# Altium schematic sheet I2C_SENSOR.SchDoc: I2C_SENSOR
size 420 x 297 mm; SheetNumber: 9; SheetTotal: 11
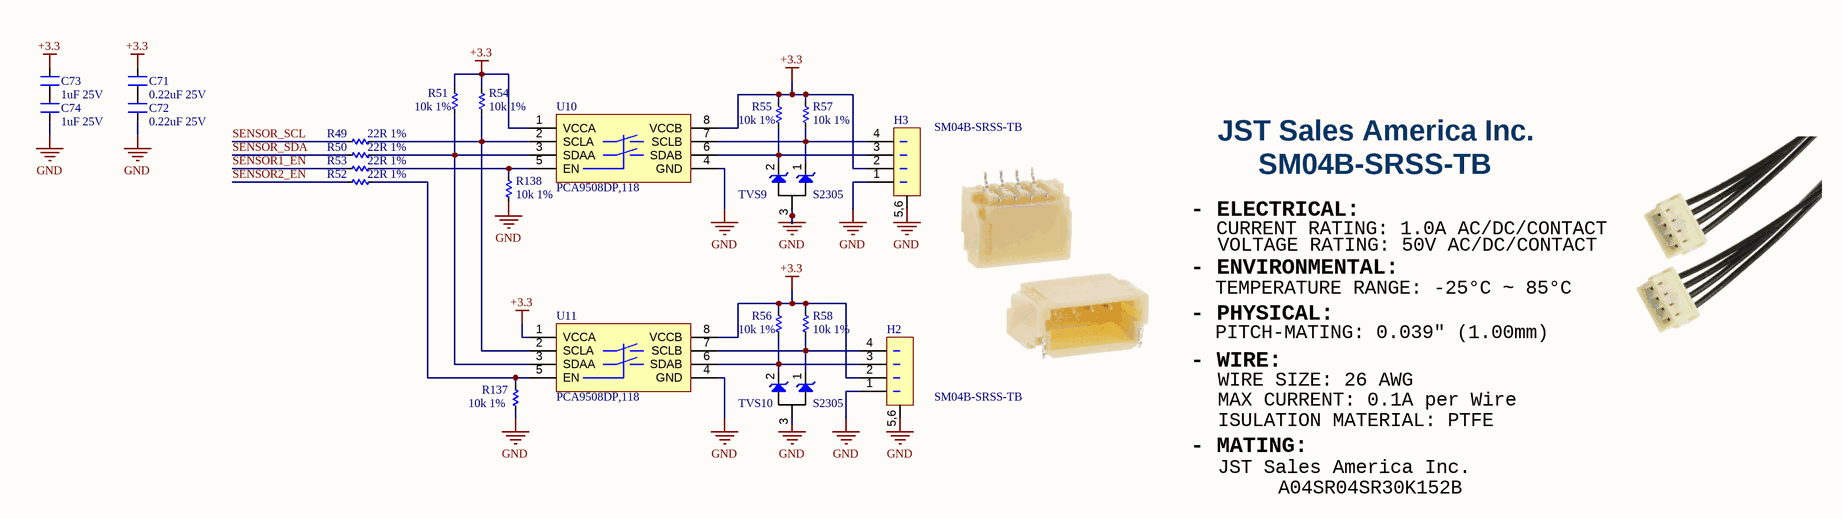
[diagram p0: I2C_SENSOR.SchDoc]

## Parts
C71  0.22uF 25V  [CN-SMD-0603]
C72  0.22uF 25V  [CN-SMD-0603]
C73  1uF 25V  [CN-SMD-0603]
C74  1uF 25V  [CN-SMD-0603]
H2  SM04B-SRSS-TB  [CONN_SM04B_JST]
H3  SM04B-SRSS-TB  [CONN_SM04B_JST]
R49  22R 1%  [RES-SMD-0603]
R50  22R 1%  [RES-SMD-0603]
R51  10k 1%  [RES-SMD-0603]
R52  22R 1%  [RES-SMD-0603]
R53  22R 1%  [RES-SMD-0603]
R54  10k 1%  [RES-SMD-0603]
R55  10k 1%  [RES-SMD-0603]
R56  10k 1%  [RES-SMD-0603]
R57  10k 1%  [RES-SMD-0603]
R58  10k 1%  [RES-SMD-0603]
R137  10k 1%  [RES-SMD-0603]
R138  10k 1%  [RES-SMD-0603]
TVS9  S2305  [sot23-12_3]
TVS10  S2305  [sot23-12_3]
U10  PCA9508DP,118  [TSOP8]
U11  PCA9508DP,118  [TSOP8]

## Nets
+3.3: C71.2 C73.2 H2.2 H3.2 R51.1 R54.1 R55.1 R56.1 R57.1 R58.1 U10.1(VCCA) U10.8(VCCB) U11.1(VCCA) U11.8(VCCB)
GND: C72.1 C74.1 H2.1 H2.5,6 H3.1 H3.5,6 R137.2 R138.2 TVS9.3 TVS10.3 U10.4(GND) U11.4(GND)
SENSOR1_EN: R53.1
SENSOR2_EN: R52.1
SENSOR_SCL: R49.1
SENSOR_SDA: R50.1
NetC71_1: C71.1 C72.2
NetC73_1: C73.1 C74.2
NetH2_3: H2.3 R56.2 TVS10.2 U11.6(SDAB)
NetH2_4: H2.4 R58.2 TVS10.1 U11.7(SCLB)
NetH3_3: H3.3 R55.2 TVS9.2 U10.6(SDAB)
NetH3_4: H3.4 R57.2 TVS9.1 U10.7(SCLB)
NetR49_2: R49.2 R54.2 U10.2(SCLA) U11.2(SCLA)
NetR50_2: R50.2 R51.2 U10.3(SDAA) U11.3(SDAA)
NetR52_2: R52.2 R137.1 U11.5(EN)
NetR53_2: R53.2 R138.1 U10.5(EN)

## Notes on the sheet
- JST Sales America Inc.
- SM04B-SRSS-TB
- - ELECTRICAL:
- CURRENT RATING: 1.0A AC/DC/CONTACT
- VOLTAGE RATING: 50V AC/DC/CONTACT
- - ENVIRONMENTAL:
- - PHYSICAL:
- TEMPERATURE RANGE: -25°C ~ 85°C
- - WIRE:
- PITCH-MATING: 0.039" (1.00mm)
- WIRE SIZE: 26 AWG
- - MATING:
- MAX CURRENT: 0.1A per Wire
- ISULATION MATERIAL: PTFE
- A04SR04SR30K152B
- Project:
- BEE-PC1
- Sub-system:
- NANORACK_EXP_CONTROLLER
- Design by:
- SANG HUYNH
- BAO BUI Q.
- Sheet title:
- Sheet
- A3
- of
- Checked by:
- Approved by:
- VU PHAM
- Revision:
- Document No:
- V1.0.0
- Size:
- Date:
- 01/10/2024

## Library data of the parts
C71-C74 = Capacitors: Value: 33pF
H2 H3 = SM04B-SRSS-TBLFSN
R49-R58 R137 R138 = Res SMD: SMD; Manufacturer: Generic Components; Class: Passive; Published: 08/06/2000; Publisher: Altium Hobart Technology Centre
TVS9 TVS10 = S2305: TVS DIODE 5VWM 10.8VC SOT23